# EAGLE design future (EAGLE 9.4.1)
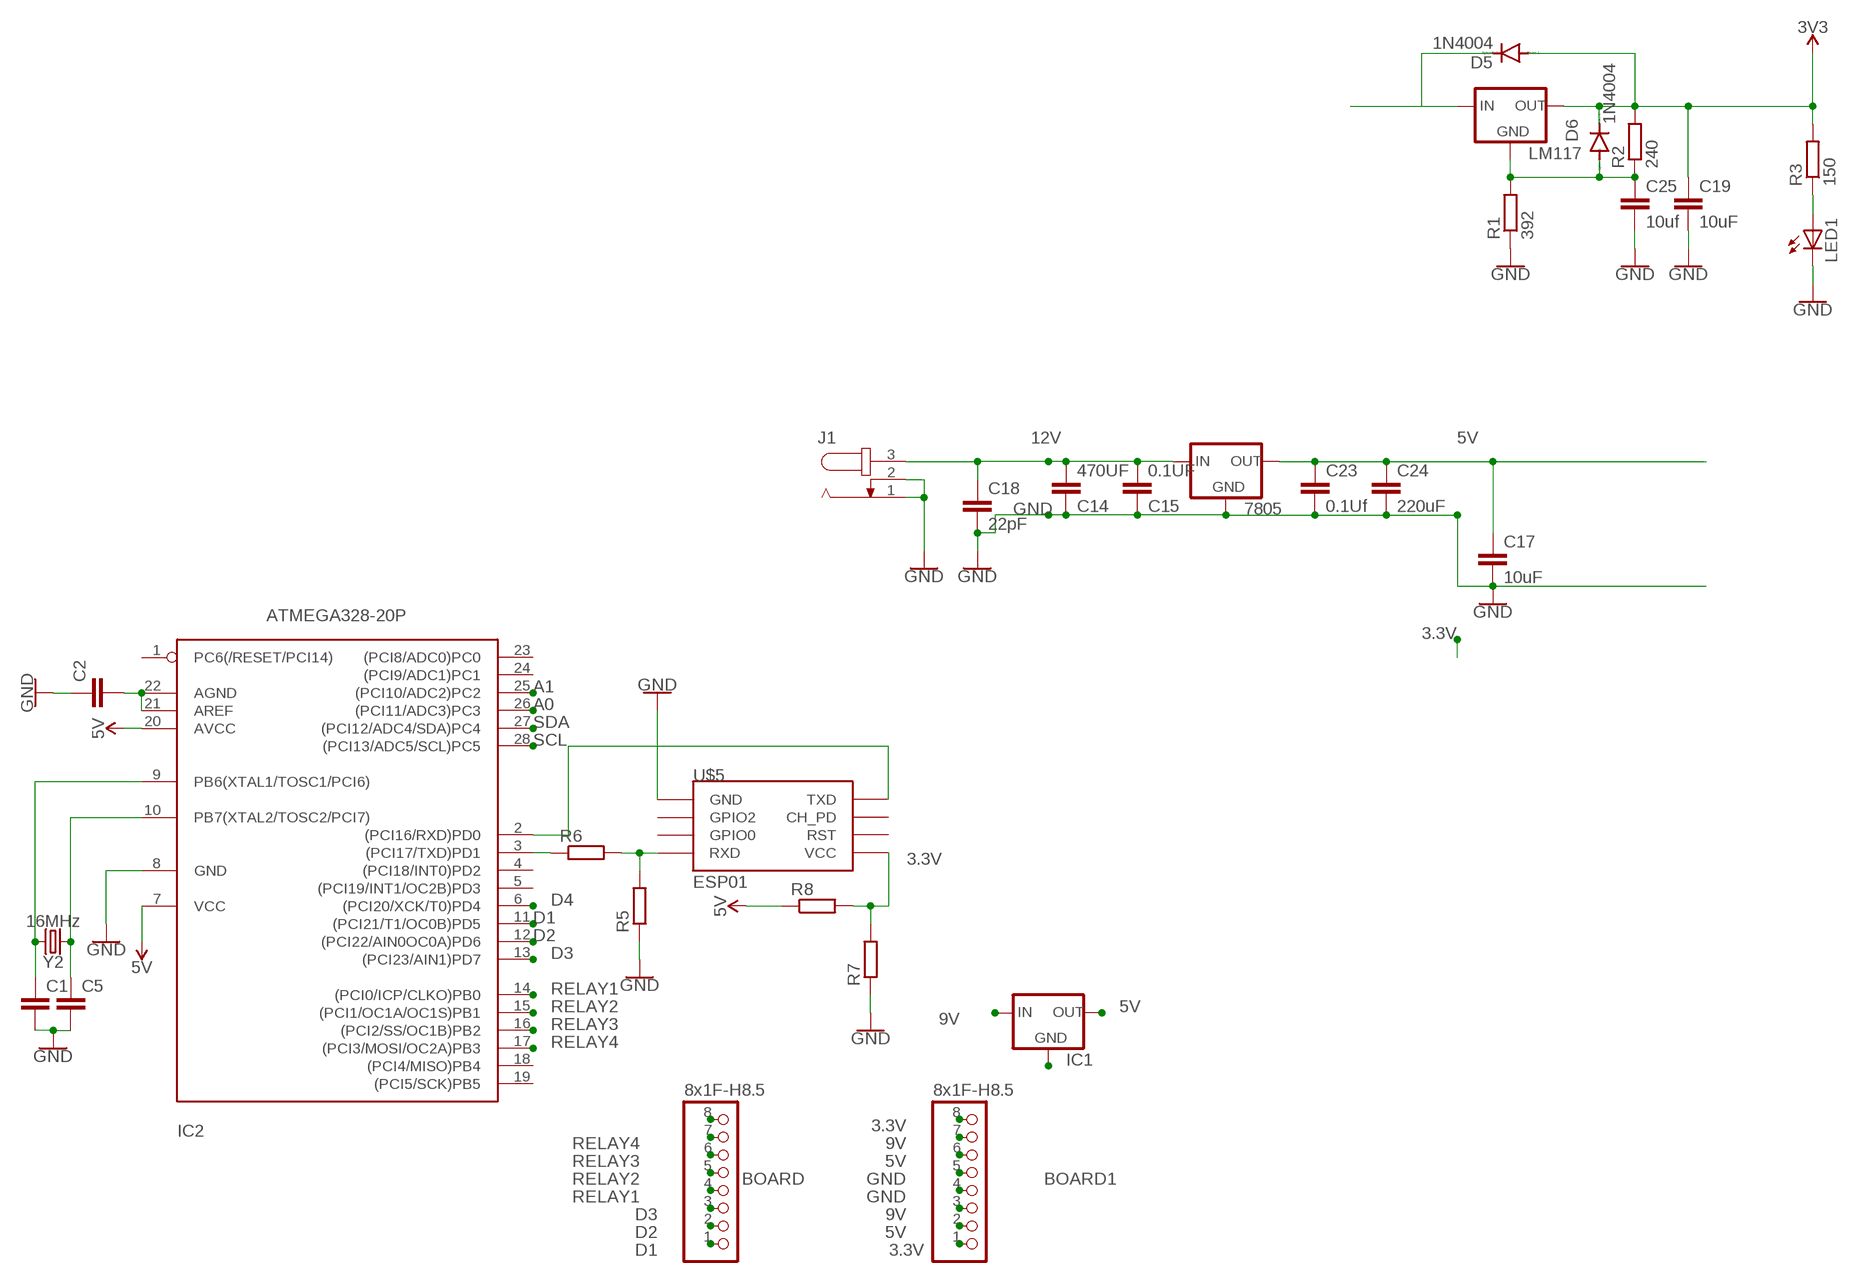
[diagram p0: schematic, sheet 1]

## Parts
7805  78XXL  [78XXL]
BOARD  8x1F-H8.5  PINHD-1X8  [1X08]
BOARD1  8x1F-H8.5  PINHD-1X8  [1X08]
C1  C2,5-3  [C2.5-3]
C2  C2,5-3  [C2.5-3]
C5  C2,5-3  [C2.5-3]
C14  470UF  22PF-0603-50V-5%  [0603]
C15  0.1UF  22PF-0603-50V-5%  [0603]
C17  10uF  22PF-0603-50V-5%  [0603]
C18  22pF  22PF-0603-50V-5%  [0603]
C19  10uF  22PF-0603-50V-5%  [0603]
C23  0.1Uf  22PF-0603-50V-5%  [0603]
C24  220uF  22PF-0603-50V-5%  [0603]
C25  10uf  22PF-0603-50V-5%  [0603]
D5  1N4004  [DO41-10]
D6  1N4004  [DO41-10]
IC1  78LXX  [78LXX]
IC2  ATMEGA328-20P  [DIL28-3]
J1  JACK-PLUG1  [SPC4078]
LED1  LED5MM  [LED5MM]
LM117  78XXL  [78XXL]
R1  392  R-EU_0204/5  [0204/5]
R2  240  R-EU_0204/5  [0204/5]
R3  150  R-EU_0204/5  [0204/5]
R5  R-EU_0204/5  [0204/5]
R6  R-EU_0204/5  [0204/5]
R7  R-EU_0204/5  [0204/5]
R8  R-EU_0204/5  [0204/5]
U$5  ESP01  [ESP01]
Y2  16MHz  CRYSTAL-16MHZPTH-HC49US  [HC49US]

## Nets
3.3V: BOARD1.1 BOARD1.8 R7.2 R8.2 U$5.VCC
5V: 7805.OUT BOARD1.2 BOARD1.6 C17.1 C19.1 C23.1 C24.1 D5.A D5.C D6.C IC1.OUT IC2.7(VCC) IC2.20(AVCC) LM117.IN LM117.OUT R2.2 R3.2 R8.1 ; supply symbol labelled 3V3
9V: BOARD1.3 BOARD1.7 IC1.IN
12V: 7805.IN C14.1 C15.1 C18.1 J1.3
A0: IC2.26((PCI11/ADC3)PC3)
A1: IC2.25((PCI10/ADC2)PC2)
D1: BOARD.1 IC2.11((PCI21/T1/OC0B)PD5)
D2: BOARD.2 IC2.12((PCI22/AIN0OC0A)PD6)
D3: BOARD.3 IC2.13((PCI23/AIN1)PD7)
D4: BOARD.8 IC2.6((PCI20/XCK/T0)PD4)
GND: 7805.GND BOARD1.4 BOARD1.5 C1.2 C2.1 C5.2 C14.2 C15.2 C17.2 C18.2 C19.2 C23.2 C24.2 C25.2 IC1.GND IC2.8(GND) J1.1 J1.2 LED1.K(C) R1.1 R5.1 R7.1 U$5.GND
N$1: R5.2 R6.2 U$5.RX(RXD)
N$2: IC2.3((PCI17/TXD)PD1) R6.1
N$3: IC2.2((PCI16/RXD)PD0) U$5.TX(TXD)
N$11: C2.2 IC2.21(AREF) IC2.22(AGND)
N$37: C25.1 D6.A LM117.GND R1.2 R2.1
N$43: C5.1 IC2.10(PB7(XTAL2/TOSC2/PCI7)) Y2.1
N$45: C1.1 IC2.9(PB6(XTAL1/TOSC1/PCI6)) Y2.2
N$57: LED1.A R3.1
RELAY1: BOARD.4 IC2.14((PCI0/ICP/CLKO)PB0)
RELAY2: BOARD.5 IC2.15((PCI1/OC1A/OC1S)PB1)
RELAY3: BOARD.6 IC2.16((PCI2/SS/OC1B)PB2)
RELAY4: BOARD.7 IC2.17((PCI3/MOSI/OC2A)PB3)
SCL: IC2.28((PCI13/ADC5/SCL)PC5)
SDA: IC2.27((PCI12/ADC4/SDA)PC4)
Unconnected: IC2.1(PC6(/RESET/PCI14)) IC2.4((PCI18/INT0)PD2) IC2.5((PCI19/INT1/OC2B)PD3) IC2.18((PCI4/MISO)PB4) IC2.19((PCI5/SCK)PB5) IC2.23((PCI8/ADC0)PC0) IC2.24((PCI9/ADC1)PC1) U$5.CH_PD U$5.GPIO0 U$5.GPIO2 U$5.RST

## Library data of the parts
7805 LM117 = v-reg:78XXL: VOLTAGE REGULATOR
BOARD BOARD1 = SmartPrj:PINHD-1X8: PIN HEADER
C1 C2 C5 = capacitor-wima:C: CAPACITOR naming: grid - package width
C14 C15 C17 C19 C23-C25 = SparkFun-Capacitors:22PF: 22pF ceramic capacitors A capacitor is a passive two-terminal electrical component used to store electrical energy temporarily in an electric field.; PROD_ID: CAP-07876; VALUE: 22pF
C18 = SparkFun-Capacitors:22PF: 22pF ceramic capacitors A capacitor is a passive two-terminal electrical component used to store electrical energy temporarily in an electric field.; PROD_ID: CAP-07876
D5 D6 = diode:1N4004: DIODE general purpose rectifier, 1 A
IC1 = v-reg:78LXX: VOLTAGE REGULATOR
IC2 = atmega328:ATMEGA328*P: MICROCONTROLLER 32 kBytes FLASH 2 kBytes SRAM 1 kBytes EEPROM USART 8-channel 10 bit ADC
J1 = con-jack:JACK-PLUG: DC POWER JACK Power Jack, DC, Right Angle, Through Hole, Rated 5A at 16VDC, PC Terminals Distributor: Farnell (www.Farnell.de) Drawing: 84N1161.pdf / 84N1162.pdf Manufacturer: SPC Technology (www.spctechnology.com) Type: SPC4077 / SPC 4078; OC_FARNELL: unknown; OC_NEWARK: unknown
LED1 = adafruit:LED: LED OSRAM: - CHIPLED LG R971, LG N971, LY N971, LG Q971, LY Q971, LO R971, LY R971 LH N974, LH R974 LS Q976, LO Q976, LY Q976 LO Q996 - Hyper CHIPLED LW Q18S LB Q993, LB Q99A, LB R99A - SideLED LS A670, LO A670, LY A670, LG A670, LP A670 LB A673, LV A673, LT A673, LW A673 LH A674 LY A675 LS A676, LA A676, LO A676, LY A676, LW A676 LS A679, LY A679, LG A679 - Hyper Micro SIDELED® LS Y876, LA Y876, LO Y876, LY Y876 LT Y87S - SmartLED LW L88C, LW L88S LB L89C, LB L89S, LG L890 LS L89K, LO L89K, LY L89K LS L896, LA L896, LO L896, LY L896 - TOPLED LS T670, LO T670, LY T670, LG T670, LP T670 LSG T670, LSP T670, LSY T670, LOP T670, LYG T670 LG T671, LOG T671, LSG T671 LB T673, LV T673, LT T673, LW T673 LH T674 LS T676, LA T676, LO T676, LY T676, LB T676, LH T676, LSB T676, LW T676 LB T67C, LV T67C, LT T67C, LS T67K, LO T67K, LY T67K, LW E67C LS E67B, LA E67B, LO E67B, LY E67B, LB E67C, LV E67C, LT E67C LW T67C LS T679, LY T679, LG T679 LS T770, LO T770, LY T770, LG T770, LP T770 LB T773, LV T773, LT T773, LW T773 LH T774 LS E675, LA E675, LY E675, LS T675 LS T776, LA T776, LO T776, LY T776, LB T776 LHGB T686 LT T68C, LB T68C - Hyper Mini TOPLED® LB M676 - Mini TOPLED Santana® LG M470 LS M47K, LO M47K, LY M47K Source: http://www.osram.convergy.de/
R1-R3 R5-R8 = resistor:R-EU_: RESISTOR, European symbol
U$5 = esp8266modules:ESP01: ESP8266 Wifi module 01
Y2 = SparkFun-Clocks:CRYSTAL-16MHZ: 16MHz Crystal Digikey Example <http://www.digikey.com/product-search/en?keywords=535-9122-1-ND> Frequency: 16MHz Frequency Stability: ±50ppm Frequency Tolerance: ±20ppm Load Capacitance: 18pF SparkFun Products: Pro Micro -5V/16MHz <https://www.sparkfun.com/products/12640> SparkFun Serial Enabled LCD Kit <https://www.sparkfun.com/products/10097>; PROD_ID: XTAL-08181; SF_ID: COM-00536

## Net classes
0 default: width 1.016 mm, clearance 0.381 mm

## Board
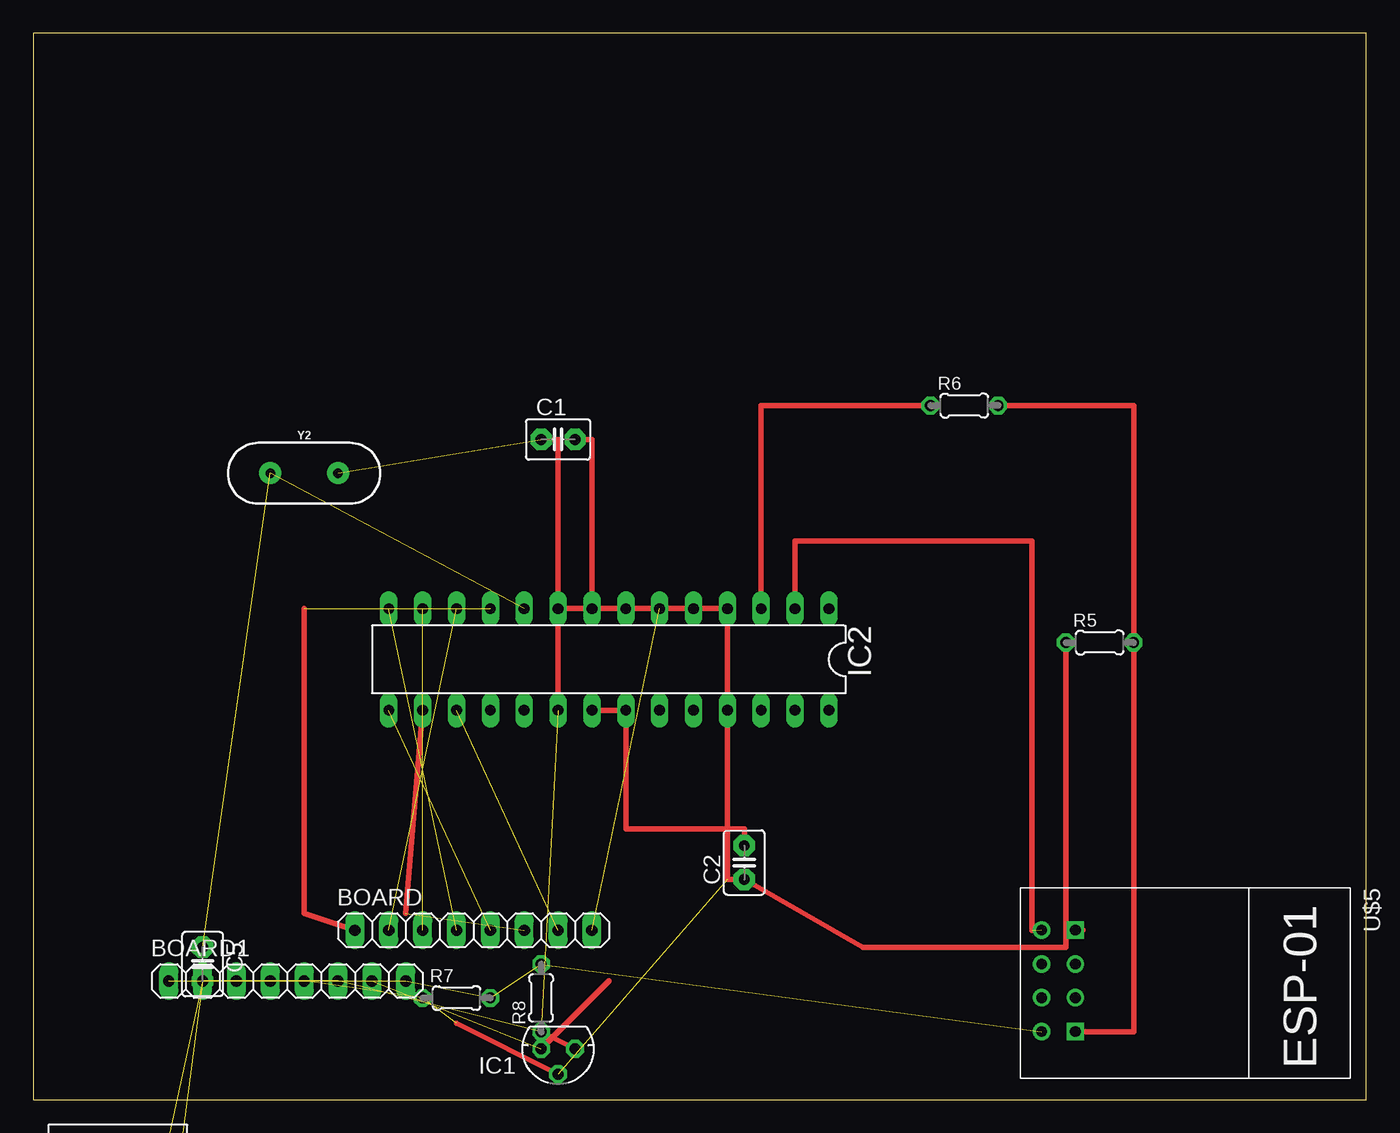
[diagram p1: board, top side]

Size 100 x 80 mm. Coordinates in mm from the lower left corner, seen from the top.
Outline: 0,0 100,0 100,80 0,80 0,0
Copper layers (1*16): Top 0.035mm / dielectric 1.5mm / Bottom 0.035mm
Design rules "default": minimum track width 6mil, minimum drill 0.35mm, track to track 6mil, track to pad 6mil, pad to pad 6mil, via to via 6mil, smd to smd 6mil, copper to edge 40mil, drill to drill 6mil, minimum pad ring 10mil, minimum via ring 8mil, stop-mask expansion 4mil, vias tented up to drill 0mil, thermal gap 10mil

### Footprints (pad centres in the part's own frame; a part is rotated, then mirrored left to right if it is on the bottom)
78XXL = drill 1.016 long: GND 0,-3.81; IN -2.54,-3.81; OUT 2.54,-3.81 | hole 3.302: 0,11.176
1X08 = drill 0.85 pad 1.422 long: 1 -8.89,0; 2 -6.35,0; 3 -3.81,0; 4 -1.27,0; 5 1.27,0; 6 3.81,0; 7 6.35,0; 8 8.89,0
C2.5-3 = drill 0.813 pad 1.6 octagon: 1 -1.27,0; 2 1.27,0
0603 = smd 1.1 x 1: 1 -0.85,0; 2 0.85,0
DO41-10 = drill 1.118: A 5.08,0; C -5.08,0
78LXX = drill 0.813 octagon: GND 0,1.905; IN 1.27,0; OUT -1.27,0
DIL28-3 = drill 0.813 long: 1 -16.51,-3.81; 2 -13.97,-3.81; 3 -11.43,-3.81; 4 -8.89,-3.81; 5 -6.35,-3.81; 6 -3.81,-3.81; 7 -1.27,-3.81; 8 1.27,-3.81; 9 3.81,-3.81; 10 6.35,-3.81; 11 8.89,-3.81; 12 11.43,-3.81; 13 13.97,-3.81; 14 16.51,-3.81; 15 16.51,3.81; 16 13.97,3.81; 17 11.43,3.81; 18 8.89,3.81; 19 6.35,3.81; 20 3.81,3.81; 21 1.27,3.81; 22 -1.27,3.81; 23 -3.81,3.81; 24 -6.35,3.81; 25 -8.89,3.81; 26 -11.43,3.81; 27 -13.97,3.81; 28 -16.51,3.81
SPC4078 = drill 0.8 pad 2.184 long: 1 -3,0; 2 0,-4.8 | drill 1 pad 2.184 long: 3 3,0
LED5MM = drill 0.813 pad 1.676 octagon: A -1.27,0; K 1.27,0
0204/5 = drill 0.813 octagon: 1 -2.54,0; 2 2.54,0
ESP01 = drill 0.8: CH_PD -1.285,-8.178; GPIO0 1.255,-5.638; GPIO2 -1.285,-5.638; RST 1.255,-8.178; TX -3.825,-8.178; VCC 3.795,-8.178 | drill 0.8 square: GND -3.825,-5.638; RX 3.795,-5.638
HC49US = drill 0.7 pad 1.651: 1 -2.54,0; 2 2.54,0

### Placement (x,y rotation side)
7805  6.35,-16.51 0 top  (outside the outline)
BOARD  33.02,12.7 0 top
BOARD1  19.05,8.89 0 top
C1  39.37,49.53 0 top
C2  53.34,17.78 90 top
C5  12.7,10.16 270 top
C14  16.51,-44.45 0 top  (outside the outline)
C15  20.32,-44.45 0 top  (outside the outline)
C17  24.13,-44.45 0 top  (outside the outline)
C18  27.94,-44.45 0 top  (outside the outline)
C19  24.13,-83.82 0 top  (outside the outline)
C23  2.54,-50.8 0 top  (outside the outline)
C24  6.35,-50.8 0 top  (outside the outline)
C25  2.54,-90.17 0 top  (outside the outline)
D5  17.78,-55.88 0 top  (outside the outline)
D6  6.35,-78.74 0 top  (outside the outline)
IC1  39.37,3.81 180 top
IC2  43.18,33.02 180 top
J1  11.43,-29.21 0 top  (outside the outline)
LED1  16.51,-77.47 0 top  (outside the outline)
LM117  6.35,-68.58 0 top  (outside the outline)
R1  3.81,-85.09 0 top  (outside the outline)
R2  11.43,-85.09 0 top  (outside the outline)
R3  19.05,-85.09 0 top  (outside the outline)
R5  80.01,34.29 0 top
R6  69.85,52.07 0 top
R7  31.75,7.62 0 top
R8  38.1,7.62 90 top
U$5  83.82,8.89 270 top
Y2  20.32,46.99 0 top

### Tracks (layer width: path | path; a pad name or v marks a point on that pad's centre or on a via)
3.3V  (4 unrouted)
5V  (15 unrouted)
  Top 0.406: IC1.OUT R8.1 | IC2.7 39.37,36.83 IC2.20
9V  (2 unrouted)
  Top 0.406: IC1.IN 43.18,8.89
12V  (4 unrouted)
D1  (1 unrouted)
  Top 0.406: BOARD.1 20.32,13.97 20.32,36.83
D2  (1 unrouted)
D3  (1 unrouted)
D4  (1 unrouted)
GND  (18 unrouted)
  Top 0.406: C1.2 41.91,49.53 IC2.8 52.07,36.83 52.07,16.51 C2.1 62.23,11.43 77.47,11.43 77.47,12.7 78.74,12.7 78.74,12.71 U$5.GND 77.47,12.71 R5.1 | IC1.GND 31.75,5.71
N$1
  Top 0.406: R6.2 82.55,52.07 R5.2 82.55,5.09 U$5.RX
N$2
  Top 0.406: IC2.3 54.61,52.07 R6.1
N$3  (1 unrouted)
  Top 0.406: IC2.2 57.15,41.91 74.93,41.91 74.93,12.7
N$11
  Top 0.406: IC2.21 IC2.22 44.45,20.32 53.34,20.32 C2.2
N$37  (4 unrouted)
N$43  (2 unrouted)
N$45  (1 unrouted)
  Top 0.406: C1.1 39.37,49.53 IC2.9
N$57  (1 unrouted)
RELAY1  (1 unrouted)
RELAY2  (1 unrouted)
RELAY3  (1 unrouted)
  Top 0.406: 27.94,13.97 IC2.16
RELAY4  (1 unrouted)